# Altium schematic sheet prog.SchDoc
size A3; Organization: HOME; Address1: L3, 12a Rodborough Rd; Address2: Frenchs Forest; Address3: NSW; Address4: Australia 2086; PageSetup: Record=PageOptions|CenterHorizontal=True|CenterVertical=True|PrintScale=0.71|XCorrection=1.00|YCorrection=1.00|PrintKind=0|BorderSize=5000000|LeftOffset=0|BottomOffset=0|Orientation=2|PaperLength=1000|PaperWidth=1000|Scale=100|PaperSource=7|PrintQuality=-3|MediaType=1|DitherType=10|PrintScaleMode=1|PaperKind=A4|PaperIndex=9
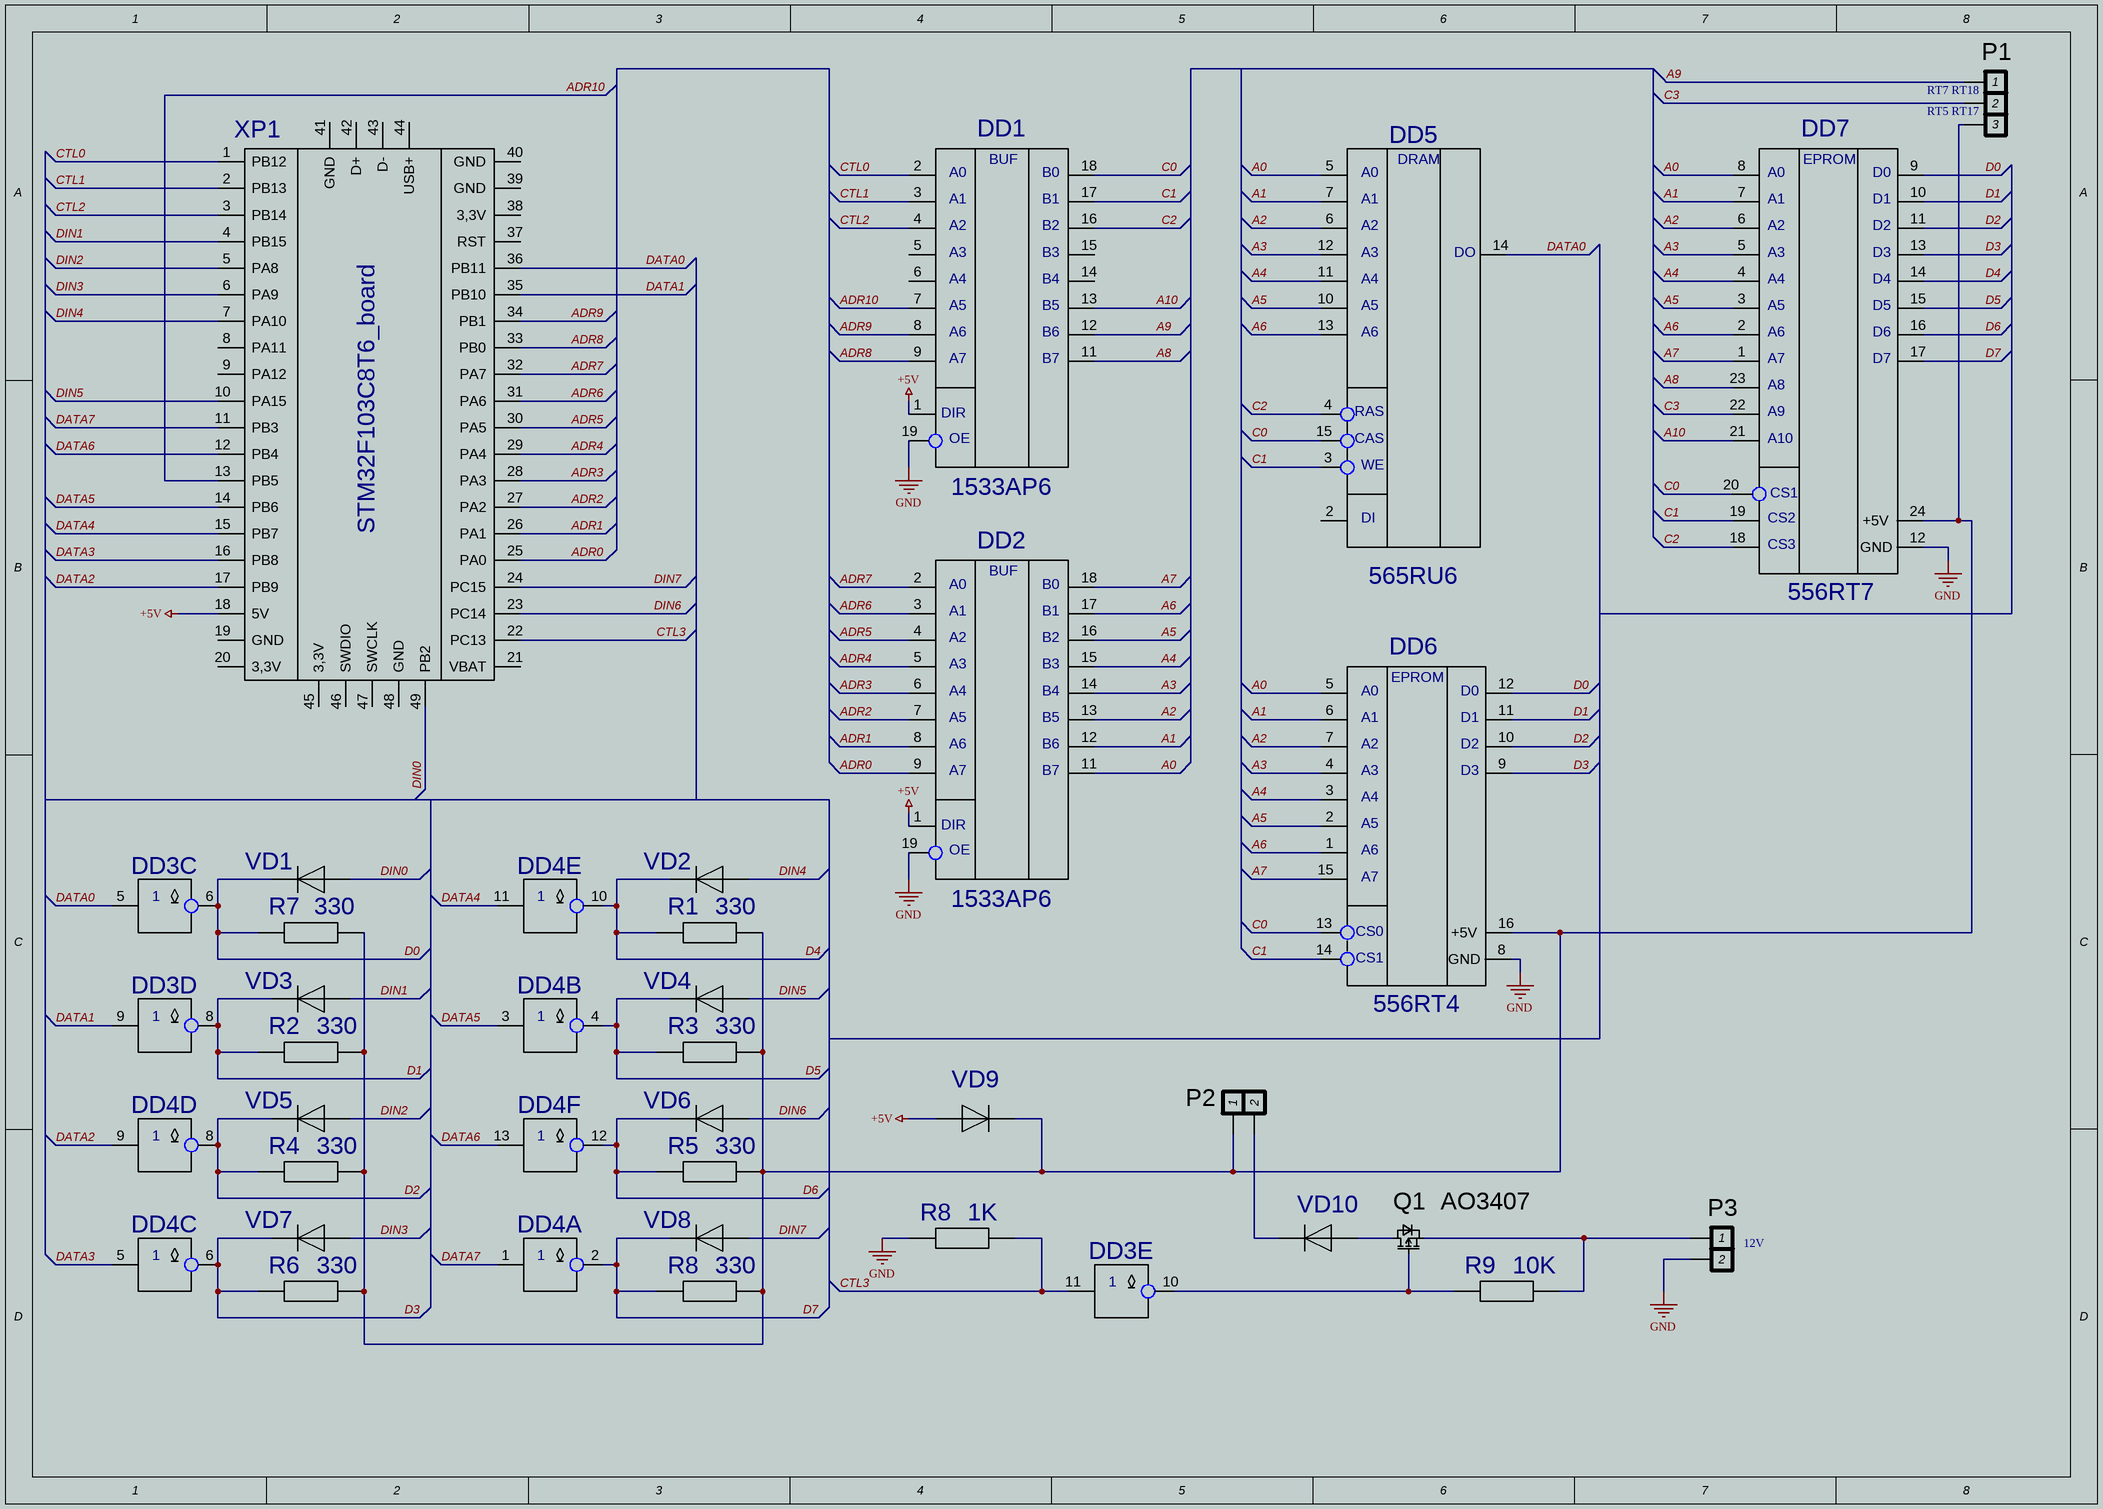
[diagram p0: prog.SchDoc]

## Parts
(Parts that share a designator on the sheet are numbered #1, #2 ... from top to bottom, then left to right.)
DD1  1533AP6  [DIP20]
DD2  1533AP6  [DIP20]
DD3  1533LN3  [DIP14]  (value not drawn)  (parts C,D,E of 6)
DD4  1533LN3  [DIP14]  (value not drawn)  (parts A,B,C,D,E,F of 6)
DD5  565RU6  [DIP16]
DD6  556RT4  [DIP16]
DD7  556RT7  [DIP24_15]
P1  Header 3  [Header 3]  (value not drawn)
P2  Header 2  [DG126]  (value not drawn)
P3  Header 2  [DG126]  (value not drawn)
Q1  AO3407  [SOT23]
R1  value 330  [R0125-2_5]  (hidden comment: R0125-2_5)
R2  value 330  [R0125-2_5]  (hidden comment: R0125-2_5)
R3  value 330  [R0125-2_5]  (hidden comment: R0125-2_5)
R4  value 330  [R0125-2_5]  (hidden comment: R0125-2_5)
R5  value 330  [R0125-2_5]  (hidden comment: R0125-2_5)
R6  value 330  [R0125-2_5]  (hidden comment: R0125-2_5)
R7  value 330  [R0125-2_5]  (hidden comment: R0125-2_5)
R8#1  value 1K  [R0125-2_5]  (hidden comment: R0125-2_5)
R8#2  value 330  [R0125-2_5]  (hidden comment: R0125-2_5)
R9  value 10K  [R0125-2_5]  (hidden comment: R0125-2_5)
VD1  (no value)  [KD522-2_5]
VD2  (no value)  [KD522-2_5]
VD3  (no value)  [KD522-2_5]
VD4  (no value)  [KD522-2_5]
VD5  (no value)  [KD522-2_5]
VD6  (no value)  [KD522-2_5]
VD7  (no value)  [KD522-2_5]
VD8  (no value)  [KD522-2_5]
VD9  (no value)  [KD522-2_5]
VD10  (no value)  [KD522-2_5]
XP1  STM32F103C8T6_board

## Nets
+5V: DD1.1(DIR) DD1.20(+5V) DD2.1(DIR) DD2.20(+5V) VD9.1(A) XP1.18(5V)
GND: DD1.10(GND) DD1.19(E0) DD2.10(GND) DD2.19(E0) DD6.8(GND) DD7.12(GND) P3.2 R8#1.1(A)
A0: DD2.11(Q7) DD5.5(A0) DD6.5(A0) DD7.8(A0)
A1: DD2.12(Q6) DD5.7(A1) DD6.6(A1) DD7.7(A1)
A2: DD2.13(Q5) DD5.6(A2) DD6.7(A2) DD7.6(A2)
A3: DD2.14(Q4) DD5.12(A3) DD6.4(A3) DD7.5(A3)
A4: DD2.15(Q3) DD5.11(A4) DD6.3(A4) DD7.4(A4)
A5: DD2.16(Q2) DD5.10(A5) DD6.2(A5) DD7.3(A5)
A6: DD2.17(Q1) DD5.13(A6) DD6.1(A6) DD7.2(A6)
A7: DD2.18(Q0) DD6.15(A7) DD7.1(A7)
A8: DD1.11(Q7) DD7.23(A8)
A9: DD1.12(Q6) P1.1
A10: DD1.13(Q5) DD7.21(A10)
ADR0: DD2.9(D6) XP1.25(PA0)
ADR1: DD2.8(D5) XP1.26(PA1)
ADR2: DD2.7(D4) XP1.27(PA2)
ADR3: DD2.6(D3) XP1.28(PA3)
ADR4: DD2.5(D2) XP1.29(PA4)
ADR5: DD2.4(D1) XP1.30(PA5)
ADR6: DD2.3(D0) XP1.31(PA6)
ADR7: DD2.2(D7) XP1.32(PA7)
ADR8: DD1.9(D6) XP1.33(PB0)
ADR9: DD1.8(D5) XP1.34(PB1)
ADR10: DD1.7(D4) XP1.13(PB5)
C0: DD1.18(Q0) DD5.15(CAS) DD6.13 DD7.20(CS)
C1: DD1.17(Q1) DD5.3(WE) DD6.14 DD7.19(A10)
C2: DD1.16(Q2) DD5.4(RAS) DD7.18
C3: DD7.22(A9) P1.2
CTL0: DD1.2(D7) XP1.1(PB12)
CTL1: DD1.3(D0) XP1.2(PB13)
CTL2: DD1.4(D1) XP1.3(PB14)
CTL3: DD3.11(A) R8#1.2(B) XP1.22(PC13)
D0: DD3.6(B) DD6.12(D0) DD7.9(D0) R7.1(A) VD1.2(B)
D1: DD3.8(B) DD6.11(D1) DD7.10(D1) R2.1(A) VD3.2(B)
D2: DD4.8(B) DD6.10(D2) DD7.11(D2) R4.1(A) VD5.2(B)
D3: DD4.6(B) DD6.9(D3) DD7.13(D3) R6.1(A) VD7.2(B)
D4: DD4.10(B) DD7.14(D4) R1.1(A) VD2.2(B)
D5: DD4.4(B) DD7.15(D5) R3.1(A) VD4.2(B)
D6: DD4.12(B) DD7.16(D6) R5.1(A) VD6.2(B)
D7: DD4.2(B) DD7.17(D7) R8#2.1(A) VD8.2(B)
DATA0: DD3.5(A) DD5.14(DO) XP1.36(PB11)
DATA1: DD3.9(A) XP1.35(PB10)
DATA2: DD4.9(A) XP1.17(PB9)
DATA3: DD4.5(A) XP1.16(PB8)
DATA4: DD4.11(A) XP1.15(PB7)
DATA5: DD4.3(A) XP1.14(PB6)
DATA6: DD4.13(A) XP1.12(PB4)
DATA7: DD4.1(A) XP1.11(PB3)
DIN0: VD1.1(A) XP1.49(PB2)
DIN1: VD3.1(A) XP1.4(PB15)
DIN2: VD5.1(A) XP1.5(PA8)
DIN3: VD7.1(A) XP1.6(PA9)
DIN4: VD2.1(A) XP1.7(PA10)
DIN5: VD4.1(A) XP1.10(PA15)
DIN6: VD6.1(A) XP1.23(PC14)
DIN7: VD8.1(A) XP1.24(PC15)
NetDD3_10: DD3.10(B) Q1.G R9.1(A)
NetDD6_16: DD6.16(+5V) DD7.24(+5V) P1.3 P2.1 R1.2(B) R2.2(B) R3.2(B) R4.2(B) R5.2(B) R6.2(B) R7.2(B) R8#2.2(B) VD9.2(B)
NetP2_2: P2.2 VD10.2(B)
NetP3_1: P3.1 Q1.S R9.2(B)
NetQ1_D: Q1.D VD10.1(A)

Not connected (* = marked no-connect by the designer): DD1 5(D2) 6(D3) 14(Q4) 15(Q3); DD3 7(GND) 14(+5V); DD4 7(GND) 14(+5V); DD5 1 2(DI) 8(+5V) 16(GND); XP1 8(PA11) 9(PA12) 19(GND) 20(3,3V) 21(VBAT) 37(RST) 38(3,3V) 39(GND) 40(GND) 41(GND) 42(D+) 43(D-) 44(USB+) 45(3,3V) 46(SWDIO) 47(SWCLK) 48(GND)

## Notes on the sheet
- (near P1) RT7 RT18
- (near P1) RT5 RT17
- (near P3) 12V
- Title
- Size:
- Date:
- File:
- A2
- Number:
- Time:
- Revision:
- Sheet
- of
- (in symbol 556RT4) EPROM; CS0; CS1
- (in symbol 556RT7) EPROM; CS1; CS2; CS3
- (in symbol 565RU6) DRAM
- (in symbol 1533AP6) BUF; A0; B0; A1; B1; A2; B2; A3; B3; A4; B4; A5; B5; A6; B6; A7; B7; OE

## Library data of the parts
Q1 = AO3407: P 30V 4.1A 52mOhm ±20V; pin to pad: D>3 G>1 S>2; Value: AO3407
VD1-VD10 = KD522-2_5: Value: *
DD1 DD2 = 1533AP6: Value: *
DD3 DD4 = 1533LN3: Value: *
DD5 = 565RU6: Value: *
DD6 = 556RT4: Value: *
DD7 = 556RT7: Value: *
XP1 = STM32F103C8T6_board: Value: *